# EAGLE board DUINOMITE-MEGA_Rev_C (EAGLE 4.16), part 1 of 2
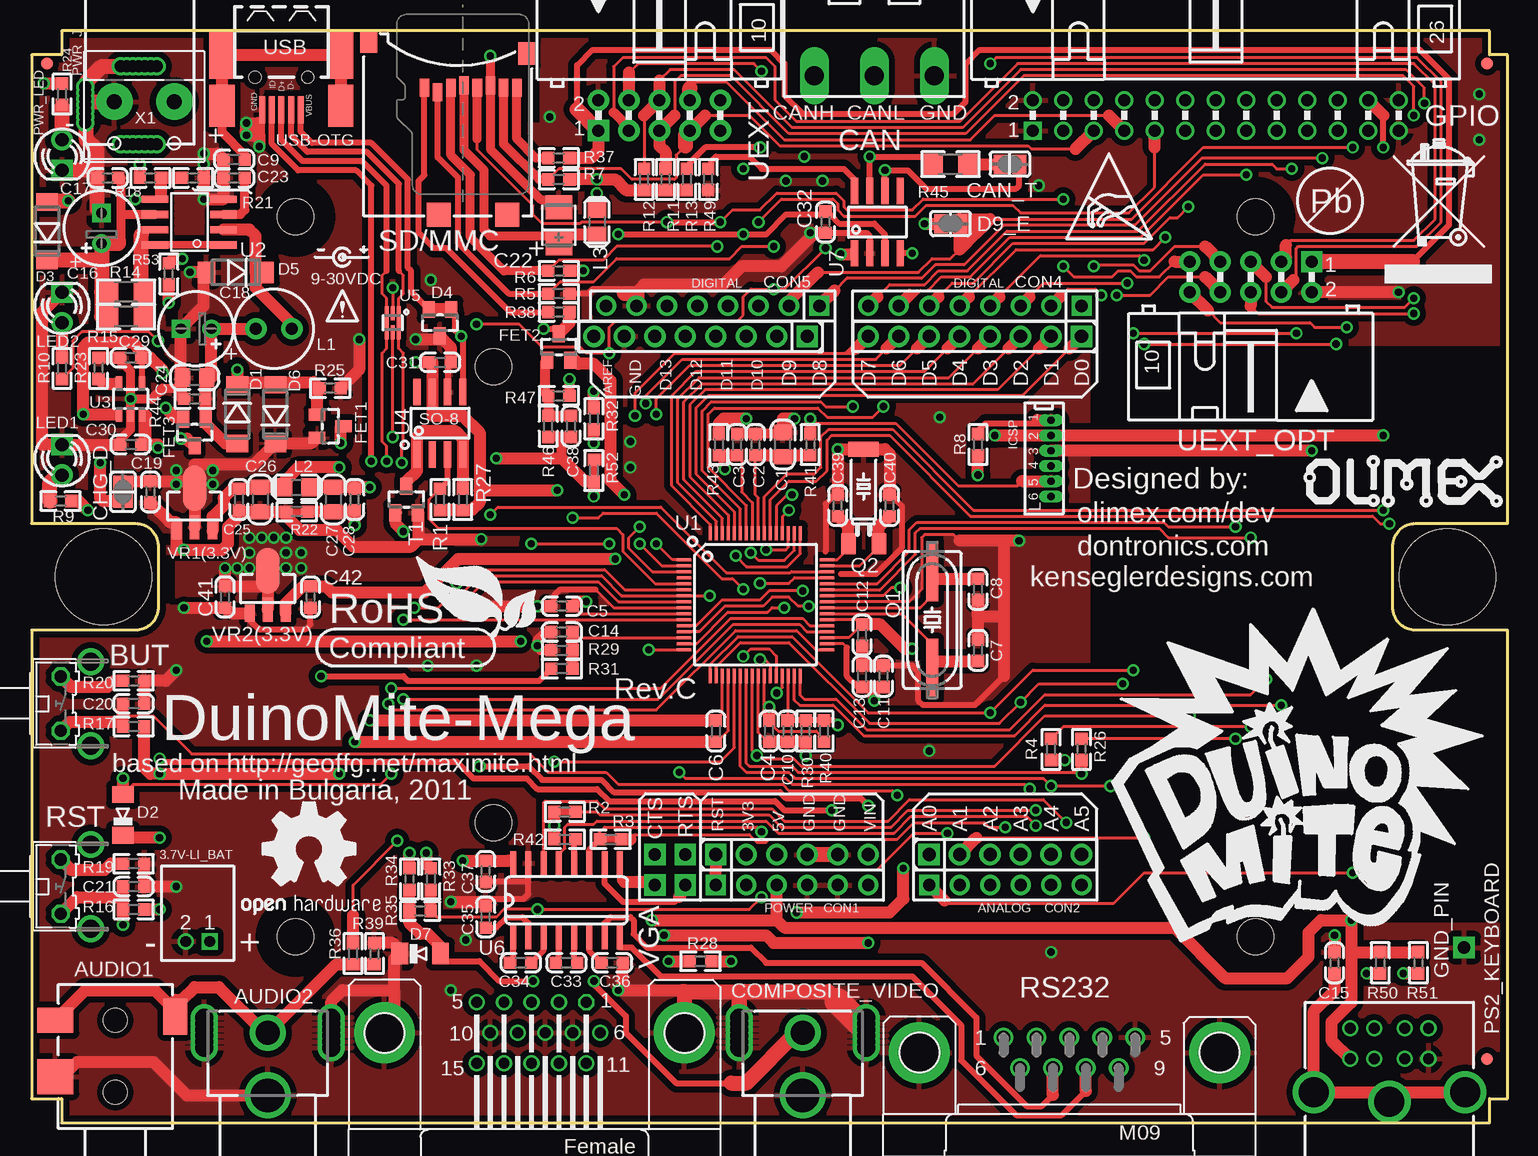
[diagram p1: board, top side]
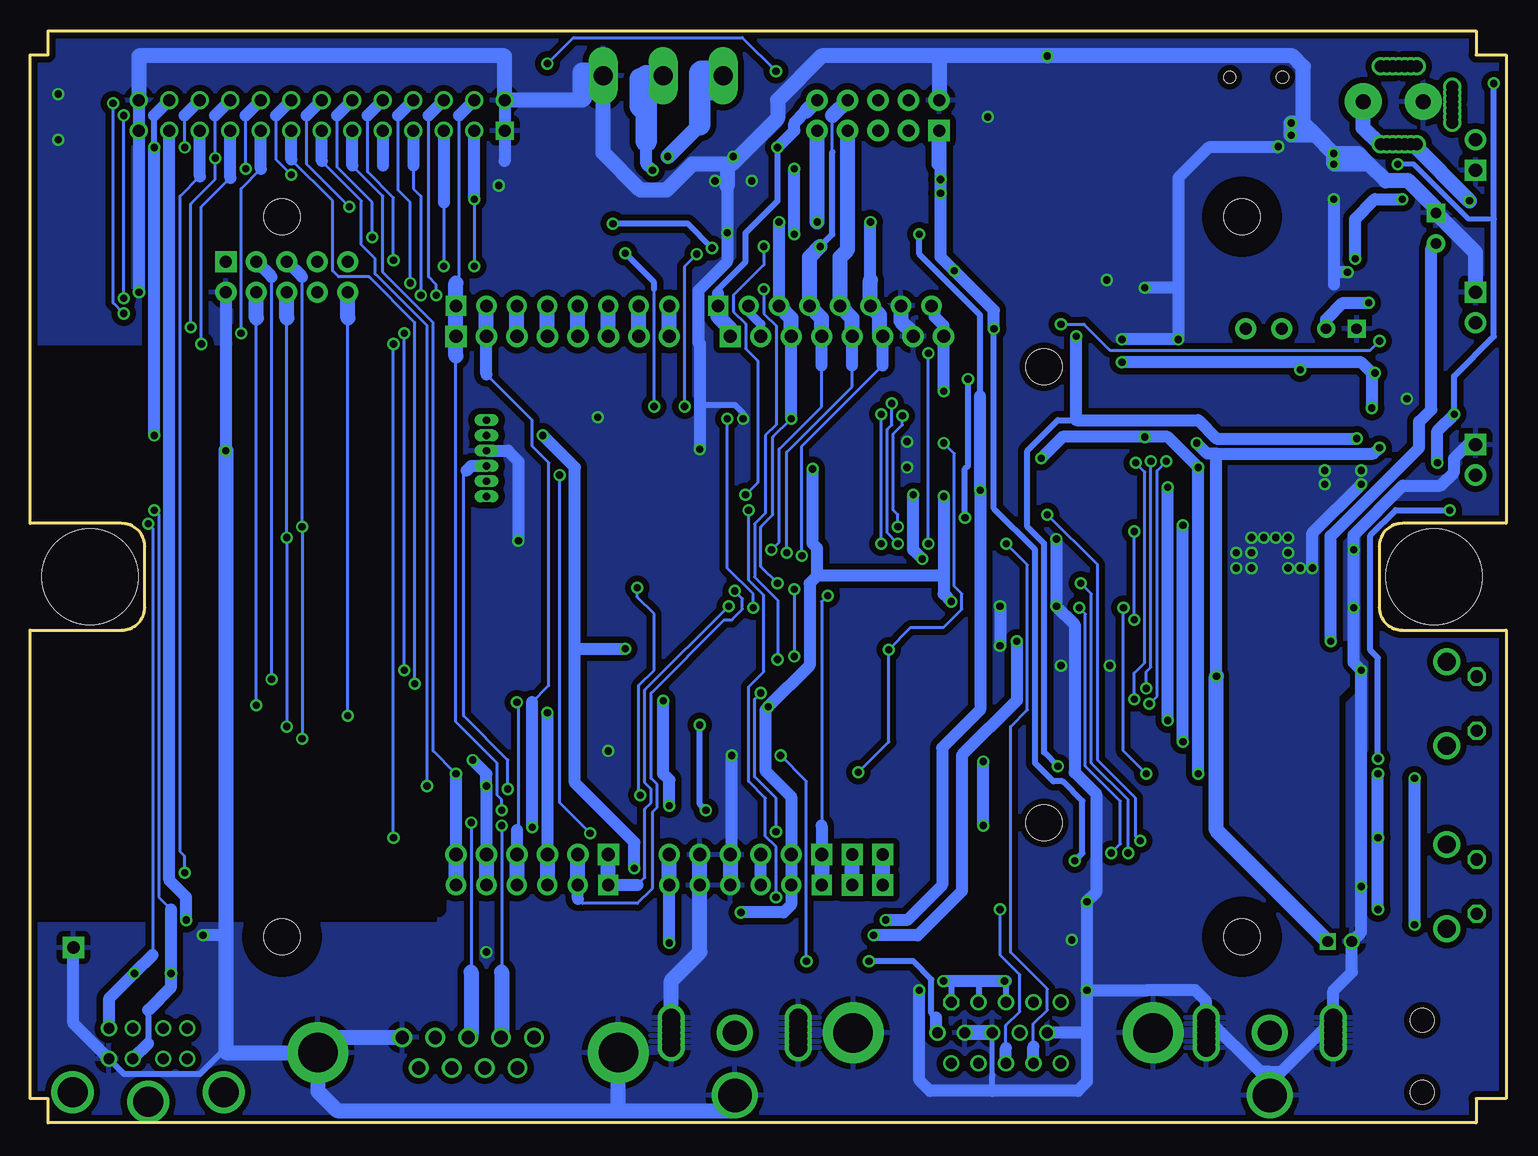
[diagram p2: board, bottom side, seen from below]

Size 123 x 91 mm. Coordinates in mm from the lower left corner, seen from the top.
Copper layers (1+16): Top 0.035mm / dielectric 1.5mm / Bottom 0.035mm
Design rules "default": minimum track width 10mil, minimum drill 0.6mm, track to track 9.5mil, track to pad 9.5mil, pad to pad 9.5mil, via to via 9.5mil, smd to smd 1mil, copper to edge 10mil, drill to drill 8mil, minimum pad ring 8mil, minimum via ring 8mil, stop-mask expansion 4mil, vias tented up to drill 25mil, thermal gap 20mil
Net classes: 1 pwr: width 0.508 mm, drill 0.241 mm
Holes 3 mm at 38.5,63 38.5,25
tRestrict: 4 lines
bRestrict: 4 lines

## Footprints (pad centres in the part's own frame; a part is rotated, then mirrored left to right if it is on the bottom)
DW02R = drill 0.9 square: 1 -1,0 | drill 0.9 round: 2 1,0
AUDIO_JACK_3.5MM_DECREASED_PAD = smd 2.9 x 3: 1 1.3,5 | smd 2.1 x 3: 2 6,5 | smd 3 x 2: 5 6.3,-5 | hole 2: 0,0; 6,0
VIDEO_CINCH = drill 1.5 pad 1.93 round: GND1 -5.3,-5.475; GND1A -5.3,-3.975; GND1B -5.3,-4.475; GND1C -5.3,-4.975; GND1D -5.3,-5.975; GND1E -5.3,-6.475; GND3 5.3,-5.475; GND3C 5.3,-4.975; GND3D 5.3,-5.975; GND3E 5.3,-6.475; GNG3A 5.3,-3.975; GNG3B 5.3,-4.475 | drill 2.8 round: GND2 0,0 | drill 2 round: IO 0,-5.2
B3F-31XX = drill 1.016 octagon: 1 -2.261,-1.245; 2 2.261,-1.245 | drill 1.499 pad 2.159 round: 3 -3.505,1.245; 4 3.505,1.245
C0805_5MIL_DWS = smd 1.27 x 1.524: 1 -1.016,0; 2 1.016,0
C0603_DWS = smd 1.016 x 1.016: 1 -0.889,0; 2 0.889,0
E2,5-6,3 = drill 0.864 pad 1.524 round: + -1.27,0 | drill 0.864 pad 1.524 square: - 1.27,0
CT3528 = smd 2 x 2.2: + -1.5,0; - 1.5,0
C0603_DWS_NA = smd 1.016 x 1.016: 1 -0.889,0; 2 0.889,0
HD-515R_3P = drill 1.6 long: 1 -5,8; 2 0,8; 3 5,8
SJ = smd 1.168 x 1.6: 1 -0.762,0; 2 0.762,0
PN1X6 = drill 1.1 pad 1.778 square: 1 -6.35,0 | drill 1.1 pad 1.778 round: 2 -3.81,0; 3 -1.27,0; 4 1.27,0; 5 3.81,0; 6 6.35,0
PN1X8 = drill 1.1 pad 1.778 square: 1 -8.89,0 | drill 1.1 pad 1.778 round: 2 -6.35,0; 3 -3.81,0; 4 -1.27,0; 5 1.27,0; 6 3.81,0; 7 6.35,0; 8 8.89,0
TEST_PAD40/70/SQUARE = drill 1.016 pad 1.778 square: P$1 0,0
MLL-41 = smd 1.45 x 1.8: A 2.445,0; K -2.445,0
MINI-MELF = smd 1.4 x 1.8: A 1.7,0; C -1.7,0
SOT-23 = smd 1 x 1.4: 1 -0.95,-1.1; 2 0.95,-1.1; 3 0,1.1
SJ-CLOSE = smd 1.168 x 1.6: 1 -0.762,0; 2 0.762,0
SOT23 = smd 1 x 1.4: 1 -0.95,-1.1; 2 0.95,-1.1; 3 0,1.1
FIDUCIAL-1X2 = smd 1 x 1: 1 0,0
BH26R = drill 1 square: 1 -15.24,-1.27 | drill 1 round: 2 -15.24,1.27; 3 -12.7,-1.27; 4 -12.7,1.27; 5 -10.16,-1.27; 6 -10.16,1.27; 7 -7.62,-1.27; 8 -7.62,1.27; 9 -5.08,-1.27; 10 -5.08,1.27; 11 -2.54,-1.27; 12 -2.54,1.27; 13 0,-1.27; 14 0,1.27; 15 2.54,-1.27; 16 2.54,1.27; 17 5.08,-1.27; 18 5.08,1.27; 19 7.62,-1.27; 20 7.62,1.27; 21 10.16,-1.27; 22 10.16,1.27; 23 12.7,-1.27; 24 12.7,1.27; 25 15.24,-1.27; 26 15.24,1.27
SW68 = drill 1 pad 1.778 round: 1 -1.5,0; 2 1.5,0
L0805_5MIL_DWS = smd 1.27 x 1.524: 1 -1.016,0; 2 1.016,0
LED-3.0MM = drill 1.092 pad 1.778 round: A -1.27,0 | drill 1.092 pad 1.778 square: K 1.27,0
PS2 = drill 0.9 round: 1 1.27,1.77; 2 -1.27,1.77; 3 3.26,1.77; 4 -3.26,1.77; 5 3.26,4.31; 6 -3.26,4.31; NC1 -1.27,4.31; NC2 1.27,4.31 | drill 2.5 round: SHIELD1 -6.3,-1; SHIELD2 0,-1.8; SHIELD3 6.3,-1
PWR_JACK_UNI_MILLING = drill 1 round: + 0,4.75; +1 0,5.25; +2 0,5.75; +3 0,6.25; +4 0,4.25; +5 0,3.75; +6 0,3.25; - -6.5,4.75; -1 -6.5,5.25; -2 -6.5,5.75; -3 -6.5,4.25; -4 -6.5,3.75; -5 -6.5,6.25; -6 -6.5,3.25; -- -3.3,0.3; --1 -3.8,0.3; --2 -4.3,0.3; --3 -4.8,0.3; --4 -2.8,0.3; --5 -2.3,0.3; --6 -1.8,0.3
HC49/SMD2_THIN = smd 5 x 1: 1 -4.064,0; 2 4.064,0
TC26H_3_REPAIR_SMD = smd 1.27 x 1.778: 1 -1.27,0; 2 1.27,0 | smd 2.54 x 1.27: GND 0,7.874
R0603_5MIL_DWS = smd 1.016 x 1.016: 1 -0.889,0; 2 0.889,0
0603_0R = smd 1.016 x 1.016: 1 -0.889,0; 2 0.889,0
R1206_5MIL_WS = smd 1.651 x 1.778: 1 -1.46,0; 2 1.46,0
DB9-BMR = drill 1.1 round: 1 -5.486,1.27; 2 -2.743,1.27; 3 0,1.27; 4 2.743,1.27; 5 5.486,1.27; 6 -4.115,-1.27; 7 -1.372,-1.27; 8 1.372,-1.27; 9 4.115,-1.27 | drill 3.302 pad 5.08 round: G1 12.522,0; G2 -12.522,0
TFR-MEM-CON = smd 0.8 x 1.5: 1 -3.2,10.7; 2 -2.1,10.3; 3 -1,10.7; 4 0.1,10.9; 5 1.2,10.7; 6 2.3,10.9; 7 3.4,10.7; 8 4.5,10.7 | smd 2 x 2: 9 3.7,0.1; 10 -2,0.1 | smd 1.4 x 1.9: 11 5.3,13.55; 12 -7.85,14.55
LPTQFP64 = smd 1.2 x 0.254: 1 -5.95,3.75; 2 -5.95,3.25; 3 -5.95,2.75; 4 -5.95,2.25; 5 -5.95,1.75; 6 -5.95,1.25; 7 -5.95,0.75; 8 -5.95,0.25; 9 -5.95,-0.25; 10 -5.95,-0.75; 11 -5.95,-1.25; 12 -5.95,-1.75; 13 -5.95,-2.25; 14 -5.95,-2.75; 15 -5.95,-3.25; 16 -5.95,-3.75; 33 5.95,-3.75; 34 5.95,-3.25; 35 5.95,-2.75; 36 5.95,-2.25; 37 5.95,-1.75; 38 5.95,-1.25; 39 5.95,-0.75; 40 5.95,-0.25; 41 5.95,0.25; 42 5.95,0.75; 43 5.95,1.25; 44 5.95,1.75; 45 5.95,2.25; 46 5.95,2.75; 47 5.95,3.25; 48 5.95,3.75 | smd 0.254 x 1.2: 17 -3.75,-5.95; 18 -3.25,-5.95; 19 -2.75,-5.95; 20 -2.25,-5.95; 21 -1.75,-5.95; 22 -1.25,-5.95; 23 -0.75,-5.95; 24 -0.25,-5.95; 25 0.25,-5.95; 26 0.75,-5.95; 27 1.25,-5.95; 28 1.75,-5.95; 29 2.25,-5.95; 30 2.75,-5.95; 31 3.25,-5.95; 32 3.75,-5.95; 49 3.75,5.95; 50 3.25,5.95; 51 2.75,5.95; 52 2.25,5.95; 53 1.75,5.95; 54 1.25,5.95; 55 0.75,5.95; 56 0.25,5.95; 57 -0.25,5.95; 58 -0.75,5.95; 59 -1.25,5.95; 60 -1.75,5.95; 61 -2.25,5.95; 62 -2.75,5.95; 63 -3.25,5.95; 64 -3.75,5.95
SO-8_TRM = smd 0.6 x 2.2: 1 -1.905,-2.854; 2 -0.635,-2.854; 3 0.635,-2.854; 4 1.905,-2.854; 5 1.905,2.854; 6 0.635,2.854; 7 -0.635,2.854; 8 -1.905,2.854
SOT-23-5 = smd 0.55 x 1.2: 1 -0.95,-1.3; 2 0,-1.3; 3 0.95,-1.3; 4 0.95,1.3; 5 -0.95,1.3
SO-8 = smd 0.6 x 2.2: 1 -1.905,-2.6; 2 -0.635,-2.6; 3 0.635,-2.6; 4 1.905,-2.6; 5 1.905,2.6; 6 0.635,2.6; 7 -0.635,2.6; 8 -1.905,2.6
USBLC6-2P6 = smd 0.3 x 1.46: 1 -0.5,-0.65; 3 0.5,-0.65; 4 0.5,0.65; 6 -0.5,0.65 | smd 0.3 x 1.16: 2 0,-0.8; 5 0,0.8
SO16-150MIL-THIN_PADS = smd 0.508 x 2.032: 1 -4.445,-3.073; 2 -3.175,-3.073; 3 -1.905,-3.073; 4 -0.635,-3.073; 5 0.635,-3.073; 6 1.905,-3.073; 7 3.175,-3.073; 8 4.445,-3.073; 9 4.445,3.073; 10 3.175,3.073; 11 1.905,3.073; 12 0.635,3.073; 13 -0.635,3.073; 14 -1.905,3.073; 15 -3.175,3.073; 16 -4.445,3.073
SO-08 = smd 0.6 x 2.2: 1 -1.905,-2.6; 2 -0.635,-2.6; 3 0.635,-2.6; 4 1.905,-2.6; 5 1.905,2.6; 6 0.635,2.6; 7 -0.635,2.6; 8 -1.905,2.6
PIC_PLATFORM_MAXMITE_WITHOUT_DIMENSIO_LAYER = drill 1.016 pad 1.676 round: 3V3 1.27,-24.13; 5V 3.81,-24.13; A1 19.05,-24.13; A2 21.59,-24.13; A3 24.13,-24.13; A4 26.67,-24.13; A5 29.21,-24.13; AREF -10.414,24.13; D1 26.67,24.13; D2 24.13,24.13; D3 21.59,24.13; D4 19.05,24.13; D5 16.51,24.13; D6 13.97,24.13; D7 11.43,24.13; D9 4.826,24.13; D10 2.286,24.13; D11 -0.254,24.13; D12 -2.794,24.13; D13 -5.334,24.13; GND 6.35,-24.13; GND@1 8.89,-24.13; GND@2 -7.874,24.13; VIN 11.43,-24.13 | drill 1.016 pad 1.676 square: A0 16.51,-24.13; D0 29.21,24.13; D8 7.366,24.13; RST -1.27,-24.13 | drill 0.6 pad 1.016 long: GND@3 26.67,12.065; PGC 26.67,9.525; PGD 26.67,10.795; PGM 26.67,8.255; RESET 26.67,14.605; VCC 26.67,13.335
124X91_FREZOVANA = hole 3: -40,30; 40,30; 40,-30; -40,-30 | hole 8: -56,0; 56,0
BH10R = drill 1 pad 1.778 square: 1 -5.08,-1.27 | drill 1 pad 1.778 round: 2 -5.08,1.27; 3 -2.54,-1.27; 4 -2.54,1.27; 5 0,-1.27; 6 0,1.27; 7 2.54,-1.27; 8 2.54,1.27; 9 5.08,-1.27; 10 5.08,1.27
USB_MINI_9PIN = smd 2.25 x 0.5: D+ 2.706,0; D- 2.706,0.8; GND 2.706,-1.6; ID 2.706,-0.8; VBUS 2.706,1.6 | smd 4 x 2.1: GND1 -1.9,4.95; GND3 -1.9,-4.95 | smd 3.5 x 2.1: GND2 2.35,4.95; GND4 2.35,-4.95 | hole 1: 0,2.2; 0,-2.2
DB15-F_22MM = drill 0.9 octagon: 1 4.329,6.35 | drill 0.9 round: 2 2.043,6.35; 3 -0.243,6.35; 4 -2.529,6.35; 5 -4.815,6.35; 6 5.472,3.81; 7 3.186,3.81; 8 0.9,3.81; 9 -1.386,3.81; 10 -3.672,3.81; 11 4.329,1.27; 12 2.043,1.27; 13 -0.243,1.27; 14 -2.529,1.27; 15 -4.815,1.27 | drill 3.302 pad 5.08 round: GND1 -12.497,3.81; GND2 12.497,3.81
SOT89_REP_THERMALOFF = smd 0.8 x 1.4: 1 -1.499,-1.981; 3 1.499,-1.981 | smd 0.8 x 2: 2 0,-1.681 | smd 1.93 x 3.81: P$2 0,1.57
W237-102 = drill 1.27 pad 3.048 round: 1 -2.5,-1.27; 2 2.5,-1.27

## Placement (x,y rotation side)
3.7V-LI_BAT  DW02R  [DW02R]  13.84,15.11 180 top
AUDIO1  SCJ325P00XG0B02G  [AUDIO_JACK_3.5MM_DECREASED_PAD]  6.99,2.54 90 top
AUDIO2  CON  [VIDEO_CINCH]  19.68,2.29 180 top
BUT  TV-06B  [B3F-31XX]  3.68,34.92 270 top
C1  10uF/6.3V  [C0805_5MIL_DWS]  62.61,56.52 90 top
C2  100nF  [C0603_DWS]  60.33,56.52 90 top
C3  100nF  [C0603_DWS]  58.8,56.52 90 top
C4  10uF/6.3V  [C0603_DWS]  61.47,32.64 270 top
C5  10uF/6.3V  [C0603_DWS]  44.2,43.05 180 top
C6  100nF  [C0603_DWS]  57.02,32.64 270 top
C7  20pF  [C0603_DWS]  78.87,39.37 270 top
C8  20pF  [C0603_DWS]  78.87,44.45 90 top
C9  10nF  [C0603_DWS]  16.89,80.26 0 top
C10  10nF  [C0603_DWS]  62.99,32.64 90 top
C11  100nF  [C0603_DWS]  70.99,37.21 270 top
C12  100nF  [C0603_DWS]  69.22,40.64 90 top
C13  2.2uF  [C0603_DWS]  69.22,37.21 90 top
C14  10nF  [C0603_DWS]  44.2,40.89 0 top
C15  10nF  [C0603_DWS]  108.58,13.34 90 top
C16  CE 100uF/35V/6.3x11mm/RM2.5  [E2,5-6,3]  5.84,74.55 90 top
C17  100nF  [C0603_DWS]  6.35,78.74 180 top
C18  CE 470uF/10V/6.3x11mm/RM2.5  [E2,5-6,3]  13.72,66.17 180 top
C19  10uF/6.3V  [C0603_DWS]  9.91,52.58 270 top
C20  100nF  [C0603_DWS]  8.51,34.92 0 top
C21  4.7nF  [C0603_DWS]  8.51,19.68 0 top
C22  47uF/6.3V/TANT  [CT3528]  43.94,74.8 90 top
C23  820pF  [C0603_DWS]  16.89,78.74 180 top
C24  10uF/6.3V  [C0805_5MIL_DWS]  13.59,62.1 180 top
C25  100nF  [C0603_DWS]  17.27,51.94 270 top
C26  10uF/6.3V  [C0805_5MIL_DWS]  19.05,51.94 270 top
C27  10uF/6.3V  [C0805_5MIL_DWS]  25.15,51.94 270 top
C28  10nF  [C0603_DWS]  26.92,51.94 270 top
C29  2.2uF  [C0603_DWS]  8.26,63.75 180 top
C30  2.2uF  [C0603_DWS]  8.26,56.52 180 top
C31  100nF  [C0603_DWS]  34.04,63.37 0 top
C32  100nF  [C0603_DWS]  66.17,75.06 270 top
C33  100nF  [C0603_DWS]  44.58,13.34 180 top
C34  100nF  [C0603_DWS]  40.77,13.34 180 top
C35  100nF  [C0603_DWS]  37.85,17.14 90 top
C36  100nF  [C0603_DWS]  48.39,13.34 0 top
C37  100nF  [C0603_DWS]  37.85,20.95 270 top
C38  1uF  [C0603_DWS]  44.96,58.04 90 top
C39  27pF  [C0603_DWS]  67.18,51.44 270 top
C40  27pF  [C0603_DWS]  71.5,51.44 270 top
C41  10uF/6.3V  [C0603_DWS_NA]  16.13,43.81 270 top
C42  10uF/6.3V  [C0603_DWS_NA]  23.24,43.81 270 top
CAN  HD-515R_3P  [HD-515R_3P]  70.23,95.25 180 top
CAN_T  Open  [SJ]  81.53,79.88 180 top
CHG_D  open  [SJ]  7.62,52.58 90 top
COMPOSITE_VIDEO  VIDEO_CON  [VIDEO_CINCH]  64.26,2.29 180 top
CON1  NA  [PN1X6]  63.37,22.35 0 top
CON2  NA  [PN1X6]  81.15,22.35 0 top
CON4  NA  [PN1X8]  78.61,65.53 180 top
CON5  NA  [PN1X8]  55.75,65.53 180 top
CTS  TESTPAD3  [TEST_PAD40/70/SQUARE]  51.94,19.81 270 top
D1  1N5819S/SS14  [MLL-41]  17.14,59.05 270 top
D2  1N4148/mini-melf  [MINI-MELF]  7.62,25.65 90 top
D3  1N5819S/SS14  [MLL-41]  1.3,74.3 90 top
D4  NA(ESDA6V1L)  [SOT-23]  34.04,66.67 180 top
D5  1N5819S/SS14  [MLL-41]  17.02,70.87 180 top
D6  1N5819S/SS14  [MLL-41]  20.32,59.05 90 top
D7  1N4148/mini-melf  [MINI-MELF]  32.38,14.1 0 top
D9_E  closed  [SJ-CLOSE]  76.58,74.93 0 top
FET1  IRLML6402  [SOT23]  24.89,58.04 270 top
FET2  IRLML6402  [SOT23]  43.94,64.64 0 top
FET3  IRLML6402  [SOT23]  13.59,57.53 180 top
FID1  FIDUCIAL1X2  [FIDUCIAL-1X2]  1.27,88.27 90 top
FID2  FIDUCIAL1X2  [FIDUCIAL-1X2]  121.28,88.27 0 top
FID3  FIDUCIAL1X2  [FIDUCIAL-1X2]  121.28,5.33 0 top
GND_PIN  TESTPAD3  [TEST_PAD40/70/SQUARE]  119.38,14.61 0 top
GPIO  BH26R  [BH26R]  98.68,83.95 0 top
L1  CL10uH SW68  [SW68]  20.19,66.17 180 top
L2  FB0805/600R/200mA(201209-601)  [L0805_5MIL_DWS]  22.1,52.96 0 top
L3  CL470nH/0805/1.76R/250mA  [L0805_5MIL_DWS]  47.12,75.06 270 top
LED1  3mm-GREEN  [LED-3.0MM]  2.54,55.24 90 top
LED2  3mm-YELLOW  [LED-3.0MM]  2.54,67.94 90 top
PS2_KEYBOARD  MD6R MINI-DIN  [PS2]  113.16,3.56 0 top
PWR_J  YDJ-1136  [PWR_JACK_UNI_MILLING]  4.19,81.53 270 top
PWR_LED  3mm-RED  [LED-3.0MM]  2.54,80.64 270 top
Q1  Q8.000MHz/HC-49SM/20pF/20ppm/SMD  [HC49/SMD2_THIN]  75.06,41.91 270 top
Q2  QCT32768(2x6)/6pF  [TC26H_3_REPAIR_SMD]  69.34,48.26 0 top
R1  10k  [R0603_5MIL_DWS]  34.04,51.94 270 top
R2  0R(board mounted)  [0603_0R]  44.45,25.91 0 top
R3  0R(board mounted)  [0603_0R]  48.26,23.62 0 top
R4  330  [R0603_5MIL_DWS]  84.96,31.11 90 top
R5  1M/1%  [R0603_5MIL_DWS]  43.94,69.09 0 top
R6  10k  [R0603_5MIL_DWS]  43.94,70.99 0 top
R7  100k  [R0603_5MIL_DWS]  43.94,78.61 0 top
R8  33R  [R0603_5MIL_DWS]  78.87,56.52 270 top
R9  680R  [R0603_5MIL_DWS]  2.41,51.82 0 top
R10  680R  [R0603_5MIL_DWS]  2.54,62.87 270 top
R11  4.7k  [R0603_5MIL_DWS]  52.83,78.61 270 top
R12  4.7k  [R0603_5MIL_DWS]  51.05,78.61 270 top
R13  100k  [R0603_5MIL_DWS]  54.61,78.61 270 top
R14  0.47R  [R1206_5MIL_WS]  7.87,69.22 0 top
R15  0.47R  [R1206_5MIL_WS]  7.87,67.18 0 top
R16  4.7k  [R0603_5MIL_DWS]  8.51,17.78 180 top
R17  4.7k  [R0603_5MIL_DWS]  8.51,33.02 180 top
R18  (NA)3k/1%  [R0603_5MIL_DWS]  9.91,78.74 0 top
R19  330R  [R0603_5MIL_DWS]  8.51,21.59 180 top
R20  330R  [R0603_5MIL_DWS]  8.51,36.83 180 top
R21  1k/1%  [R0603_5MIL_DWS]  13.46,78.74 0 top
R22  0R(board mounted)  [0603_0R]  22.1,50.93 0 top
R23  15k  [R0603_5MIL_DWS]  5.59,62.87 270 top
R24  330R  [R0603_5MIL_DWS]  2.54,85.72 270 top
R25  10k  [R0603_5MIL_DWS]  24.89,61.21 0 top
R26  330  [R0603_5MIL_DWS]  87.5,31.11 90 top
R27  10k  [R0603_5MIL_DWS]  35.94,51.94 270 top
R28  10k  [R0603_5MIL_DWS]  55.75,13.46 0 top
R29  470k/1%  [R0603_5MIL_DWS]  44.2,39.37 0 top
R30  100k/1%  [R0603_5MIL_DWS]  64.52,32.64 90 top
R31  1M/1%  [R0603_5MIL_DWS]  44.2,37.85 180 top
R32  120R  [R0603_5MIL_DWS]  46.86,58.67 270 top
R33  1k  [R0603_5MIL_DWS]  33.27,20.32 270 top
R34  120R  [R0603_5MIL_DWS]  31.5,20.32 270 top
R35  680R  [R0603_5MIL_DWS]  32.38,17.65 180 top
R36  5.6k  [R0603_5MIL_DWS]  26.8,14.1 270 top
R37  100k  [R0603_5MIL_DWS]  43.94,80.39 0 top
R38  100k  [R0603_5MIL_DWS]  43.94,67.56 0 top
R39  1k  [R0603_5MIL_DWS]  28.57,14.1 90 top
R40  1M/1%  [R0603_5MIL_DWS]  66.04,32.64 270 top
R41  4.7k  [R0603_5MIL_DWS]  64.9,56.52 90 top
R42  330R  [R0603_5MIL_DWS]  44.45,23.62 0 top
R43  10k  [R0603_5MIL_DWS]  57.28,56.52 270 top
R44  10k  [R0603_5MIL_DWS]  13.59,60.33 180 top
R45  120R  [R1206_5MIL_WS]  76.58,79.88 180 top
R46  100k  [R0603_5MIL_DWS]  43.05,58.04 90 top
R47  10k  [R0603_5MIL_DWS]  43.94,60.58 0 top
R49  10k  [R0603_5MIL_DWS]  56.39,78.61 90 top
R50  4.7k  [R0603_5MIL_DWS]  112.39,13.34 270 top
R51  4.7k  [R0603_5MIL_DWS]  115.57,13.34 270 top
R52  0R(board mounted)  [0603_0R]  46.86,54.36 90 top
R53  3.3k/1%  [R0603_5MIL_DWS]  11.43,70.74 90 top
RS232  DB9-MALE  [DB9-BMR]  86.49,5.84 0 top
RST  TV-06B  [B3F-31XX]  3.68,19.68 270 top
RTS  TESTPAD3  [TEST_PAD40/70/SQUARE]  54.48,19.81 270 top
SD/MMC  MICRO  [TFR-MEM-CON]  35.94,75.56 0 top
T1  DTC114YKA  [SOT-23]  31.24,51.94 0 top
U1  PIC32MX795F512H-80I/PT  [LPTQFP64]  60.33,43.18 0 top
U2  MC33063ADR(SO8)  [SO-8_TRM]  13.16,75.06 90 top
U3  MCP73812T-420I/OT  [SOT-23-5]  8.26,60.33 0 top
U4  LM3526M-L(SO8)  [SO-8]  34.04,58.29 0 top
U5  NA(USBLC6-2P6)  [USBLC6-2P6]  30.1,66.67 180 top
U6  ST3232(SO16)  [SO16-150MIL-THIN_PADS]  44.58,18.54 0 top
U7  MCP2551  [SO-08]  70.48,75.06 0 top
U$1  3x(PN1x8)+1x(PN1x6)+WU06S  [PIC_PLATFORM_MAXMITE_WITHOUT_DIMENSIO_LAYER]  58.29,43.94 0 top
U$2  [LOGO-OPENHARDWARE_8X8]  23.11,22.73 0 top
U$4  [DUINOMITE1]  90.5,14.83 0 top
U$5  [124X91_FREZOVANA]  62,45.5 180 top
U$12  [ATTENTION_SMALL]  24.64,66.8 0 top
U$17  [OLIMEX1_V]  123.75,51.18 0 top
U$18  [PB]  108.2,76.83 0 top
U$19  [ESD_SYMBOL]  86.23,73.66 0 top
U$20  [ROHS]  24.77,38.71 0 top
U$21  [RECYCLE_BIN1/4]  112.78,69.98 0 top
UEXT  BH10R  [BH10R]  52.32,83.95 0 top
UEXT_OPT  BH10R  [BH10R]  101.6,70.48 180 top
USB-OTG  USB-OTG  [USB_MINI_9PIN]  20.83,87.12 270 top
VGA_DB15-F  DB1522  [DB15-F_22MM]  41.91,3.68 0 top
VR1(3.3V)  MCP1700T-3302E/MB  [SOT89_REP_THERMALOFF]  13.59,51.31 0 top
VR2(3.3V)  NA(MCP1700T-3302E/MB)  [SOT89_REP_THERMALOFF]  19.68,44.45 0 top
X1  NA  [W237-102]  9.4,83.82 180 top